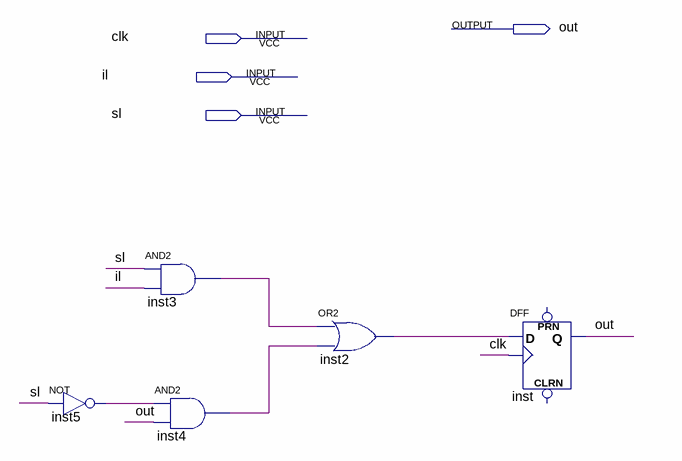
[diagram p0: schematic sheet]
// Quartus schematic SLReg1.bdf as structural Verilog: 5 symbols, 4 pins
module SLReg1 (
  input  clk,
  input  il,
  input  sl,
  output out
);

  wire inst2_out, inst3_out, inst4_out, inst5_out;

  not inst5 (inst5_out, sl);
  and inst3 (inst3_out, sl, il);
  and inst4 (inst4_out, inst5_out, out);
  or inst2 (inst2_out, inst3_out, inst4_out);
  DFF inst (.CLK(clk), .D(inst2_out), .Q(out));  // open: CLRN, PRN
endmodule
